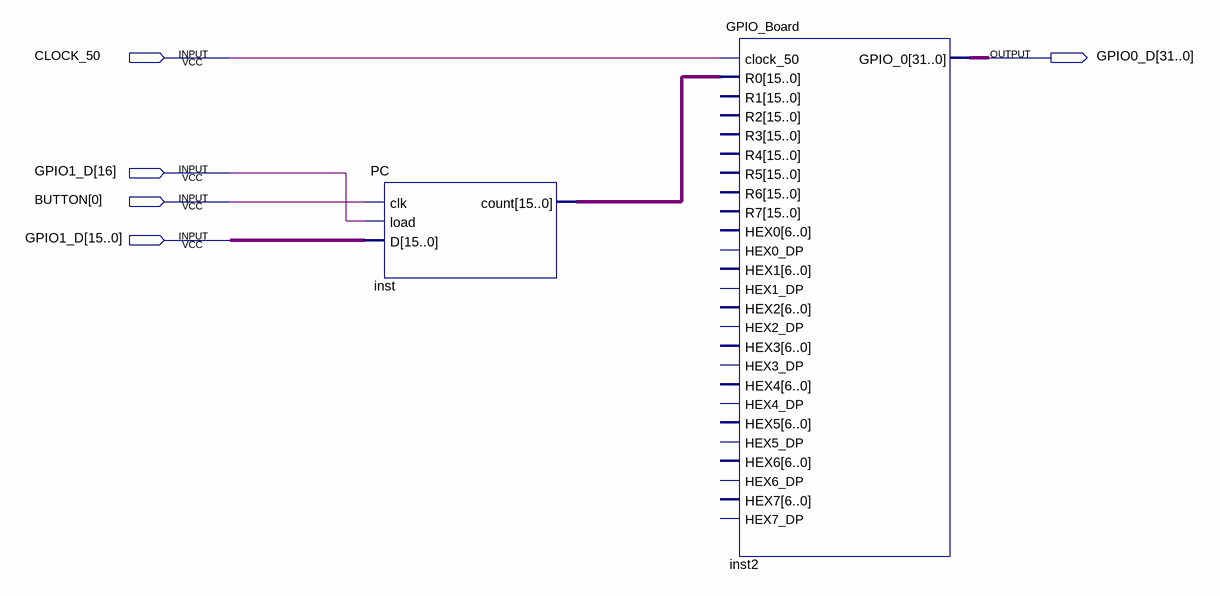
[diagram p0: schematic sheet]
// Quartus schematic PCtest.bdf as structural Verilog: 2 symbols, 5 pins
module PCtest (
  input  CLOCK_50,
  input  [16:0] GPIO1_D,
  input  [0:0] BUTTON,
  output [31:0] GPIO0_D
);

  wire [15:0] inst_count;

  PC inst (.clk(BUTTON[0]), .load(GPIO1_D[16]), .D(GPIO1_D[15:0]), .count(inst_count));
  GPIO_Board inst2 (
    .clock_50(CLOCK_50), .R0(inst_count), .GPIO_0(GPIO0_D));  // open: R1, R2, R3, R4, R5, R6, R7, HEX0, HEX0_DP, HEX1, HEX1_DP, HEX2, HEX2_DP, HEX3, HEX3_DP, HEX4, HEX4_DP, HEX5, HEX5_DP, HEX6, HEX6_DP, HEX7, HEX7_DP
endmodule
